# EAGLE design CHIP_dispv3.0 (EAGLE 7.6.0)
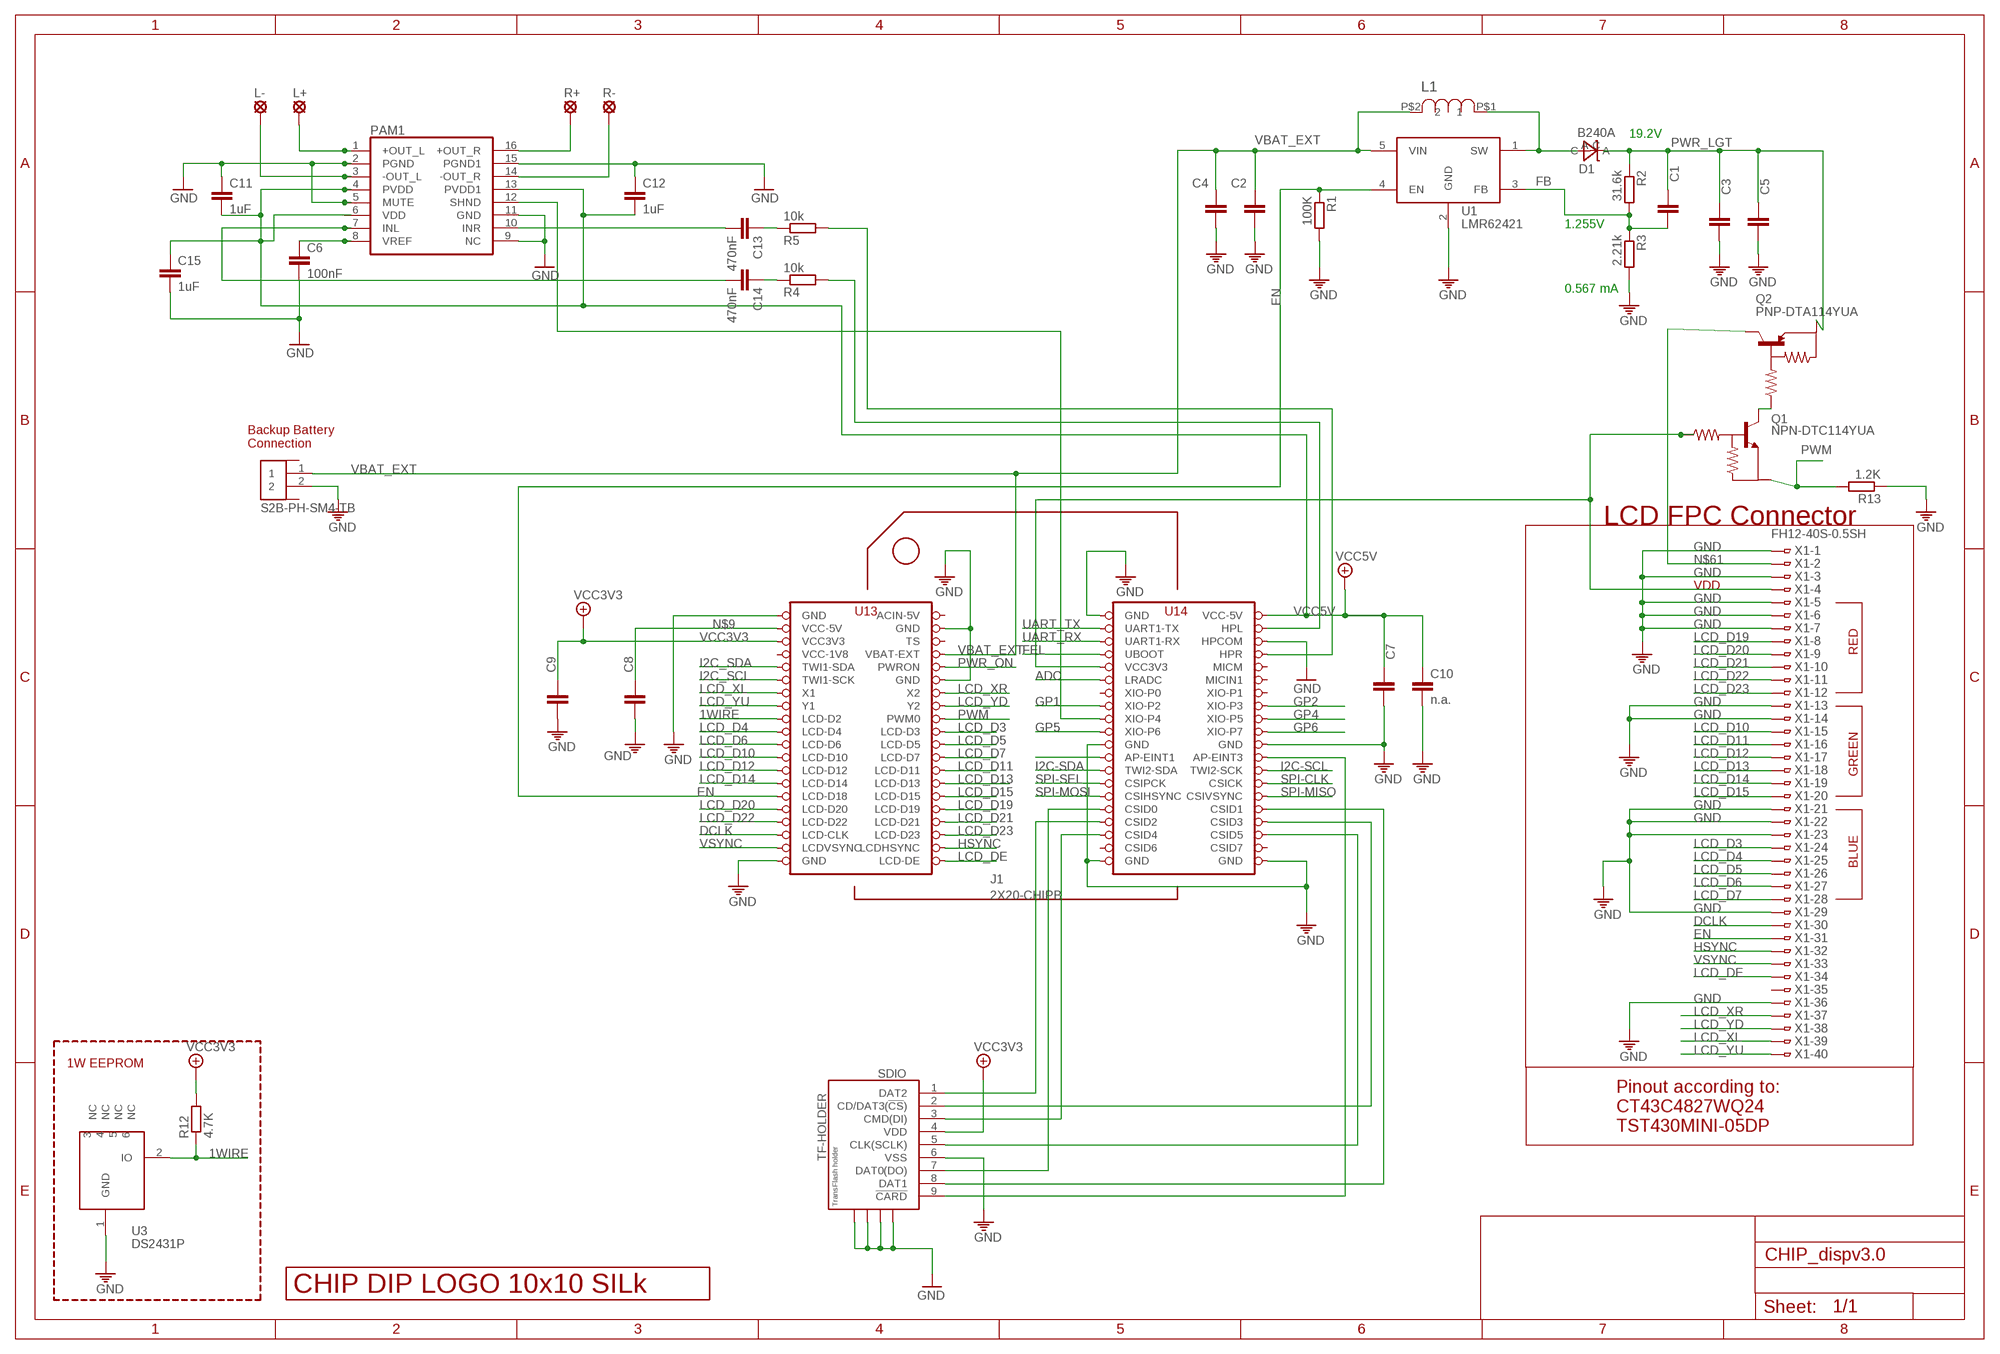
[diagram p0: schematic, sheet 1]

## Parts
C1  220pF  C-EUC0805  [C0805]
C2  100nF  C-EUC0805  [C0805]
C3  100nF  C-EUC0805  [C0805]
C4  22uF  C-EUC0805  [C0805]
C5  22uF  C-EUC0805  [C0805]
C6  100nF  C-EUC0805  [C0805]
C7  n.a.  C-EUC0805  [C0805]
C8  100nF  C-EUC0805  [C0805]
C9  100nF  C-EUC0805  [C0805]
C10  n.a.  C-EUC0805  [C0805]
C11  1uF  C-EUC0805  [C0805]
C12  1uF  C-EUC0805  [C0805]
C13  470nF  C-EUC0805  [C0805]
C14  470nF  C-EUC0805  [C0805]
C15  1uF  C-EUC0805  [C0805]
D1  B240A  DIODE_SCHTKY_B240  [DO-214AC]
J1  2X20-CHIPB  [2X20CHIP_SM]
J3  S2B-PH-SM4-TB  [S2B-PH-SM4-TB]
L1  SRN6045-100M  [SRN6045]
L+  SE11  [SE11]
L-  SE11  [SE11]
PAM1  PAM8403  [SOP-16]
Q1  NPN-DTC114YUA  [SOT323]
Q2  PNP-DTA114YUA  [SOT323]
R1  100K  R-EU_M0805  [M0805]
R2  31.6k  R-EU_M0805  [M0805]
R3  2.21k  R-EU_M0805  [M0805]
R4  10k  R-EU_R0805  [R0805]
R5  10k  R-EU_R0805  [R0805]
R12  4.7K  R-EU_M0805  [M0805]
R13  1.2K  R-EU_M0805  [M0805]
R+  SE11  [SE11]
R-  SE11  [SE11]
SDIO  TF-HOLDER  [TF-PULL]
U1  LMR62421  [SOT23-5]
U3  DS2431P  [TSOC6]
U$2  LOGO_10X10_SILK  [LOGO2_10X10_SILK]
X1  FH12-40S-0.5SH  [FH12-40S-0.5SH]

## Nets
1WIRE: J1.LCD-D2 R12.1 U3.2(IO)
ADC: J1.LRADC
DCLK: J1.LCD-CLK X1.30
EN: J1.LCD-D18 R1.1 U1.4(EN) X1.31
FB: C1.2 R2.2 R3.1 U1.3(FB)
FEL: J1.FEL(UBOOT)
GND: C2.2 C3.2 C4.2 C5.2 C6.2 C7.2 C8.2 C9.2 C10.2 C11.1 C12.1 C15.2 J1.GND@1(GND) J1.GND@2(GND) J1.GND@3(GND) J1.GND@4(GND) J1.GND@5(GND) J1.GND@6(GND) J1.GND@7(GND) J1.GND@8(GND) J1.GND@10(GND) J1.HPCOM J3.2 PAM1.2(PGND) PAM1.5(MUTE) PAM1.9(NC) PAM1.11(GND) PAM1.15(PGND1) R1.2 R3.2 R13.1 SDIO.6(VSS) SDIO.S1 SDIO.S2 SDIO.S3 SDIO.S4 U1.2(GND) U3.1(GND) X1.1 X1.3 X1.5 X1.6 X1.7 X1.13 X1.14 X1.21 X1.22 X1.23 X1.29 X1.36
GP1: J1.XIO-P2
GP2: J1.XIO-P3
GP3: J1.XIO-P4 PAM1.12(SHND)
GP4: J1.XIO-P5
GP5: J1.XIO-P6
GP6: J1.XIO-P7
HSYNC: J1.LCD-HSYNC(LCDHSYNC) X1.32
I2C-SCL: J1.TWI2-SCK
I2C-SDA: J1.TWI2-SDA
I2C_SCL: J1.TWI1-SCK
I2C_SDA: J1.TWI1-SDA
KPD_INT: J1.AP-EINT1
LCD_D3: J1.LCD-D3 X1.24
LCD_D4: J1.LCD-D4 X1.25
LCD_D5: J1.LCD-D5 X1.26
LCD_D6: J1.LCD-D6 X1.27
LCD_D7: J1.LCD-D7 X1.28
LCD_D10: J1.LCD-D10 X1.15
LCD_D11: J1.LCD-D11 X1.16
LCD_D12: J1.LCD-D12 X1.17
LCD_D13: J1.LCD-D13 X1.18
LCD_D14: J1.LCD-D14 X1.19
LCD_D15: J1.LCD-D15 X1.20
LCD_D19: J1.LCD-D19 X1.8
LCD_D20: J1.LCD-D20 X1.9
LCD_D21: J1.LCD-D21 X1.10
LCD_D22: J1.LCD-D22 X1.11
LCD_D23: J1.LCD-D23 X1.12
LCD_DE: J1.LCD-DE X1.34
LCD_XL: J1.X1 X1.39
LCD_XR: J1.X2 X1.37
LCD_YD: J1.Y2 X1.38
LCD_YU: J1.Y1 X1.40
N$1: J1.CSID0 SDIO.7(DAT0(DO))
N$9: C8.1 J1.VCC5V@0(VCC-5V)
N$25: J1.CSID4 SDIO.3(CMD(DI))
N$26: J1.VCC3V3@1(VCC3V3) Q1.1(IN) X1.4
N$27: J1.CSID1 SDIO.8(DAT1)
N$28: J1.CSID3 SDIO.2(CD/DAT3(!CS!))
N$31: J1.CSID2 SDIO.1(DAT2)
N$32: L+.MP PAM1.1(+OUT_L)
N$33: L-.MP PAM1.3(-OUT_L)
N$34: PAM1.16(+OUT_R) R+.MP
N$35: PAM1.14(-OUT_R) R-.MP
N$36: C14.2 PAM1.7(INL)
N$37: J1.HPR R5.2
N$38: C6.1 PAM1.8(VREF)
N$39: C13.2 PAM1.10(INR)
N$40: J1.HPL R4.2
N$41: C13.1 R5.1
N$42: C14.1 R4.1
N$44: J1.CSID5 SDIO.5(CLK(SCLK))
N$45: J1.AP-EINT3 SDIO.9(!CARD)
N$61: Q2.3(OUT) X1.2
N$63: Q1.3(OUT) Q2.1(IN)
PWM: J1.PWM0 Q1.2(GND) R13.2
PWR_LGT: C1.1 C3.1 C5.1 D1.C Q2.2(GND) R2.1
PWR_ON: J1.PWRON
SPI-CLK: J1.CSICK
SPI-MISO: J1.CSIVSYNC
SPI-MOSI: J1.CSIHSYNC
SPI-SEL: J1.CSIPCK
UART_RX: J1.UART1-RX
UART_TX: J1.UART1-TX
VBAT_EXT: C2.1 C4.1 J1.BAT(VBAT-EXT) J3.1 L1.P$2 U1.5(VIN)
VCC3V3: C9.1 J1.VCC3V3 R12.2 SDIO.4(VDD)
VCC5V: C7.1 C10.1 C11.2 C12.2 C15.1 J1.VCC5V@1(VCC-5V) PAM1.4(PVDD) PAM1.6(VDD) PAM1.13(PVDD1)
VREG_OUTPUT: D1.A L1.P$1 U1.1(SW)
VSYNC: J1.LCD-VSYNC(LCDVSYNC) X1.33
Unconnected: J1.CHG-IN(ACIN-5V) J1.CSID6 J1.CSID7 J1.MICIN1 J1.MICM J1.TS J1.XIO-P0 J1.XIO-P1 J3.MNT1 J3.MNT2 U3.3(NC) U3.4(NC) U3.5(NC) U3.6(NC) X1.35

## Notes on the sheet
- 19.2V
- 1.255V
- 0.567 mA
- Backup Battery
  Connection
- LCD FPC Connector
- VDD
- RED
- GREEN
- BLUE
- 1W EEPROM
- Pinout according to:
  CT43C4827WQ24
  TST430MINI-05DP

## Power pins joined to a net without a drawn wire
VCC-1V8: J1.VCC1V8(VCC-1V8)

## Library data of the parts
C1-C15 = rcl:C-EU: CAPACITOR, European symbol
D1 = Keyboard v0_5:DIODE_SCHTKY_B240; DESCRIPTION: DIODE SMD General Purpose 400V 1A 1.4W RoHS DO-214AC; FOOTPRINT: DO-214AC; LINK: http://www.digikey.com/product-detail/en/B240A-13-F/B240A-FDICT-ND/717810; MFG: DIGIKEY; MFG_PN: B240A-FDICT-ND; PART_TYPE: DIODE; PRICE: 0.11; VENDOR: DIODES; VENDOR_PART_NUMBER: B240A-13-F
J1 = JKW_CHIP:2X20-CHIP: Through hole layout with chip reference
J3 = Keyboard v0_5:S2B-PH-SM4-TB; DESCRIPTION: 2 pin con, 2MM RA, SMD; FOOTPRINT: S2B-PH-SM4-TB; LINK: http://www.digikey.com/product-detail/en/S2B-PH-SM4-TB(LF)(SN)/455-1749-1-ND/926846; MFG: DIGIKEY; MFG_PN: 455-1749-1-ND; PART_TYPE: CON; PRICE: 0.26; VENDOR: JST; VENDOR_PART_NUMBER: S2B-PH-SM4-TB(LF)(SN)
L1 = Keyboard v0_5:SRN6045-100M; DESCRIPTION: power inductor 10uH 2.5A 58.6 mohm; FOOTPRINT: SRN6045; LINK: http://www.digikey.com/product-detail/en/SRN6045-100M/SRN6045-100MTR-ND/2756120; MFG: DIGIKEY; MFG_PN: SRN6045-100MTR-ND; PART_TYPE: IND; PRICE: 0.15; TOLLERANCE: ±20%; VENDOR: BOURNS; VENDOR_PART_NUMBER: SRN6045-100M
L+ L- R+ R- = solpad:SE11: SOLDER PAD RTM, drill 1,1mm, distributor Buerklin, 07F810
PAM1 = JKW_CHIP:PAM8403: Dual channel audio amplifier IC - PAM8403
Q1 = PocketCHIP-Components-v0.72:NPN-DTC114YUA
Q2 = PocketCHIP-Components-v0.72:PNP-DTA114YUA
R1-R5 R12 R13 = rcl:R-EU_: RESISTOR, European symbol
SDIO = JKW_CHIP:TF-HOLDER: TF / Micro SD socket is PUSH-PUSH type, the card can be pushed into and auto locked and pushed out by simply press the card. Surface Mounting type.
U1 = PocketCHIP-Components-v0.7:LMR62421; DESCRIPTION: dc/dc step up, 2.1A, 1.6mhz, SOT-23-5; FOOTPRINT: SOT23-5; LINK: http://www.digikey.com/product-detail/en/LMR62421XMFE%2FNOPB/LMR62421XMFE%2FNOPBCT-ND/2777085; MFG: DIGIKEY; MFG_PN: LMR62421XMFE/NOPBCT-ND; PART_TYPE: IC; PRICE: 0.8; VENDOR: TEXAS INSTRUMENTS; VENDOR_PART_NUMBER: LMR62421XMFE/NOPB
U3 = Keyboard v0_5:DS2431: 1024-Bit EEPROM This chip provides a 4x256 Bit EEPROM, which can be programmed@5V. Write protection and OTP emulation are available, too. Author: Jan Kandziora <jjj@gmx.de>; DESCRIPTION: IC, 1024-Bit, 1-Wire EEPROM, TSOC6; FOOTPRINT: TSOC6; LINK: http://www.digikey.com/product-detail/en/DS2431P%2BT%26R/DS2431P%2BT%26RCT-ND/3647900; MFG: DIGIKEY; MFG_PN: DS2431P+T&RCT-ND; PART_TYPE: IC; PRICE: 0.98; VENDOR: MAXIM; VENDOR_PART_NUMBER: DS2431P+T&R
U$2 = JKW_CHIP:LOGO_10X10_SILK
X1 = Keyboard v0_5:FH12-40S-0.5S: 0.5mm Pitch Connectors For FPC/FFC Source: Data sheet <http://www.hirose.co.jp/cataloge_hp/e58605370.pdf>; DESCRIPTION: CON ffc smd, bottom contact 40pos, 0.50mm R/A; FOOTPRINT: FH12-40S-0.5SH; LINK: http://www.digikey.com/product-detail/en/FH12-40S-0.5SH(55)/HFJ140CT-ND/1110388; MFG: DIGIKEY; MFG_PN: HFJ140CT-ND; VENDOR: HIROSE; VENDOR_PART_NUMBER: FH12-40S-0.5SH(55)

## Board
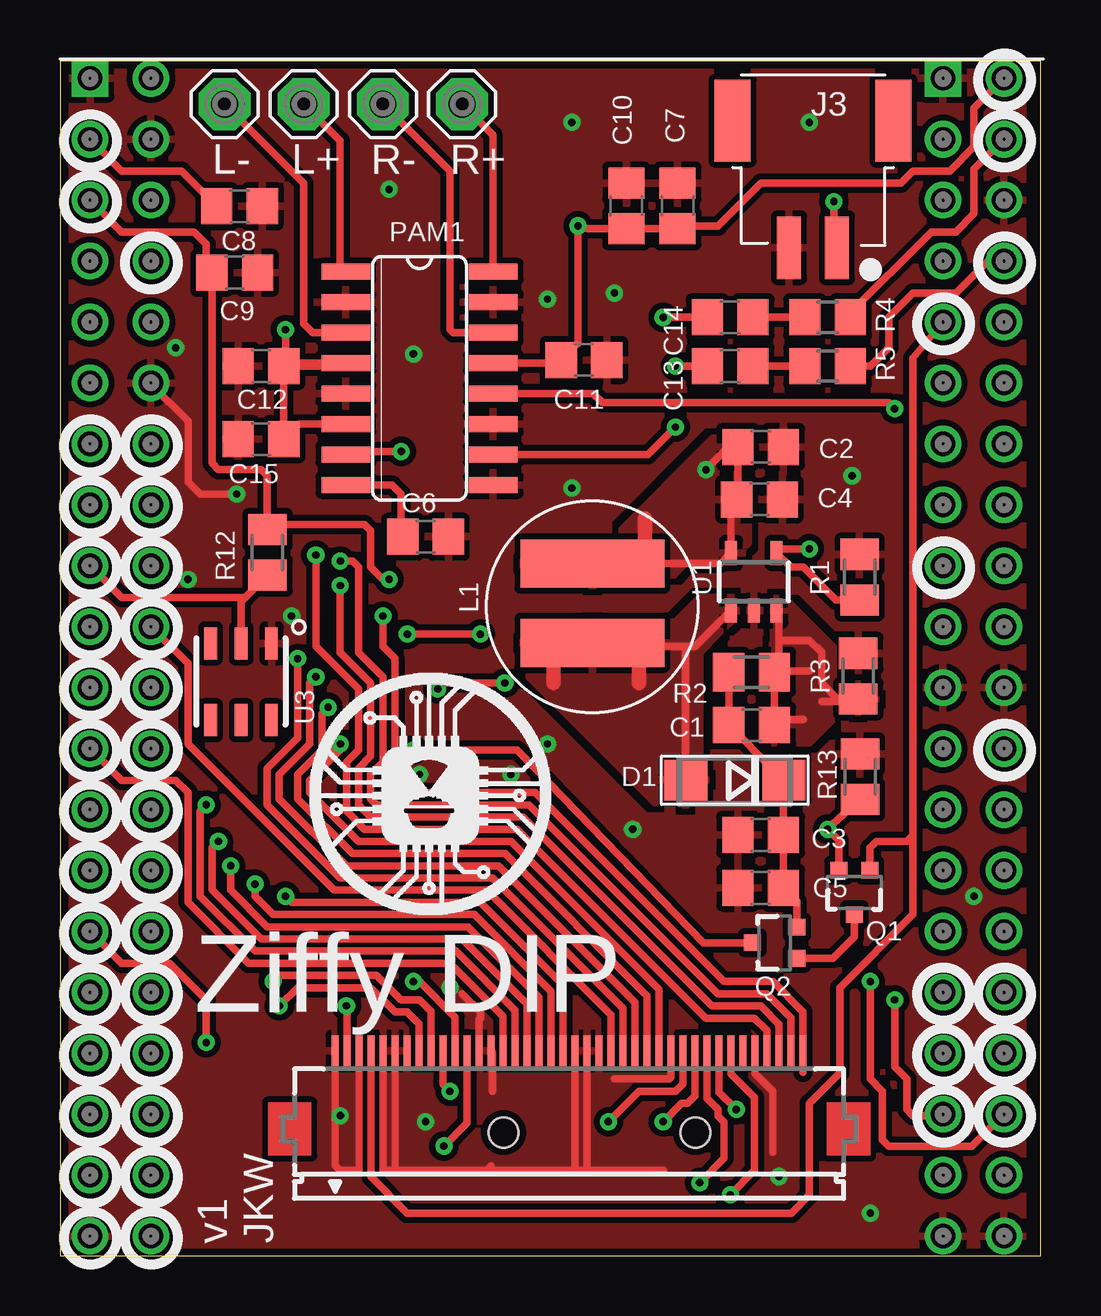
[diagram p1: board, top side]
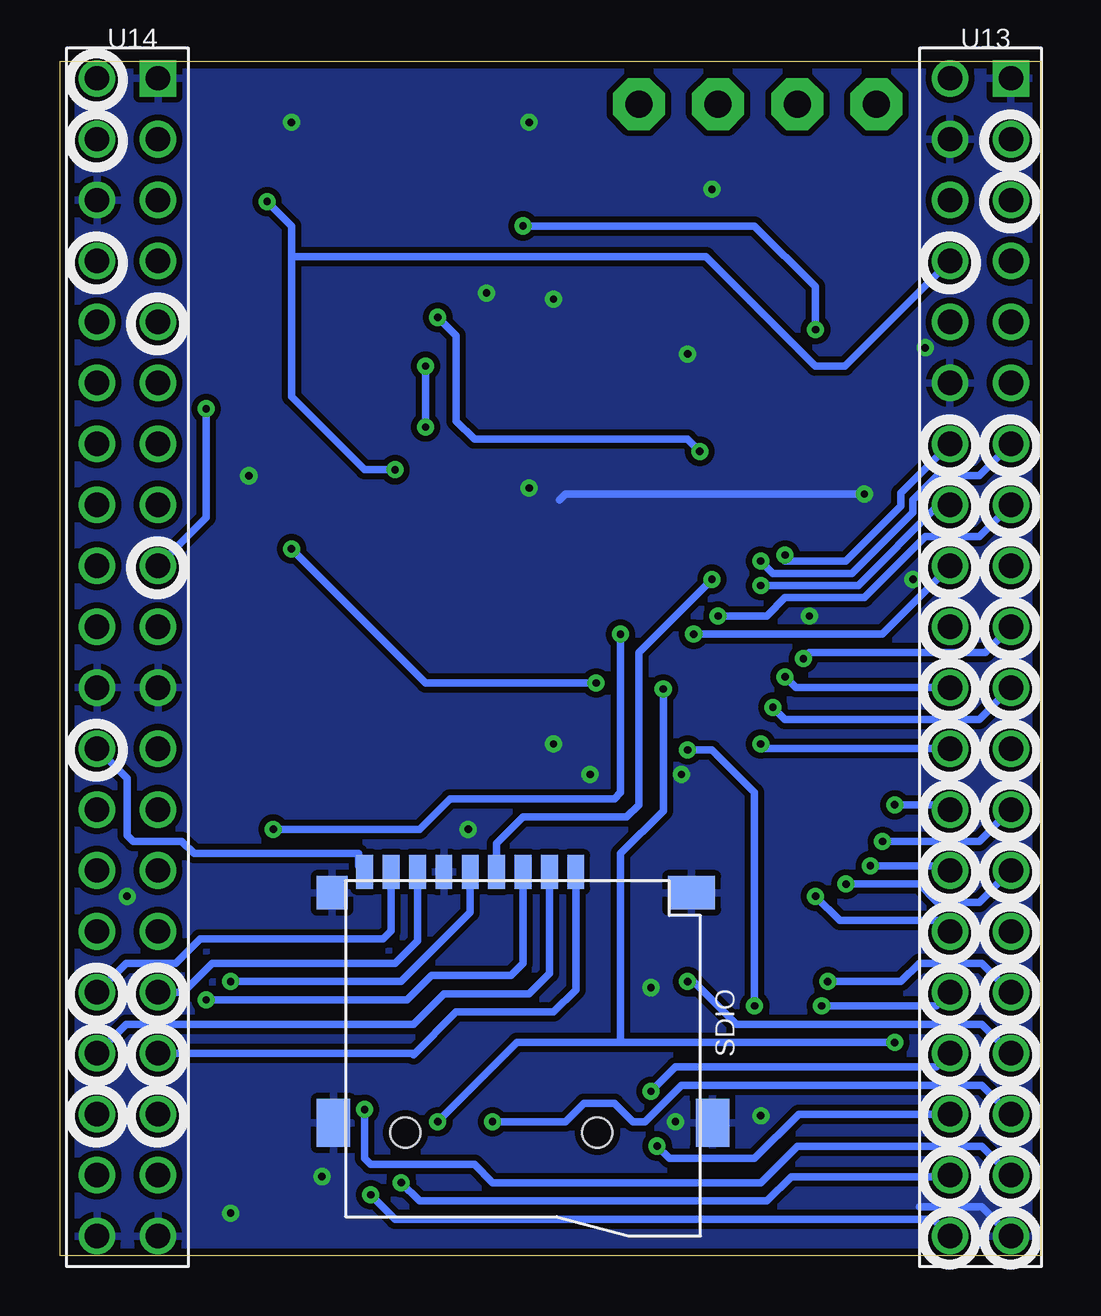
[diagram p2: board, bottom side, seen from below]

Size 40.89 x 49.78 mm. Coordinates in mm from the lower left corner, seen from the top.
Outline: 0,0 40.89,0 40.89,49.78 0,49.78 0,0
Copper layers (1*2*15*16): Top 0.035mm / dielectric 0.2mm / Route2 0.035mm / dielectric 0.2mm / Route15 0.035mm / dielectric 0.2mm / Bottom 0.035mm
Design rules "Hampoo *": minimum track width 3mil, minimum drill 8mil, track to track 3mil, track to pad 3mil, pad to pad 3mil, via to via 3mil, smd to smd 3mil, copper to edge 12mil, drill to drill 8mil, minimum pad ring 10mil, minimum via ring 8mil, stop-mask expansion 4mil, vias tented up to drill 24mil, thermal gap 10mil

### Footprints (pad centres in the part's own frame; a part is rotated, then mirrored left to right if it is on the bottom)
C0805 = smd 1.3 x 1.5: 1 -0.95,0; 2 0.95,0
DO-214AC = smd 1.8 x 1.7: A 2.05,0; C -2.05,0
2X20CHIP_SM = drill 1.016: AP-EINT1 36.81,21.65; AP-EINT3 39.35,21.65; BAT 3.79,41.97; CHG-IN 3.79,49.59; CSICK 39.35,16.57; CSID0 36.81,11.49; CSID1 39.35,11.49; CSID2 36.81,8.95; CSID3 39.35,8.95; CSID4 36.81,6.41; CSID5 39.35,6.41; CSID6 36.81,3.87; CSID7 39.35,3.87; CSIHSYNC 36.81,14.03; CSIPCK 36.81,16.57; CSIVSYNC 39.35,14.03; FEL 36.81,41.97; GND@1 3.79,36.89; GND@2 1.25,1.33; GND@4 39.35,24.19; GND@5 39.35,1.33; GND@6 36.81,1.33; GND@7 36.81,24.19; GND@10 3.79,47.05; HPCOM 39.35,44.51; HPL 39.35,47.05; HPR 39.35,41.97; LCD-CLK 1.25,6.41; LCD-D2 1.25,29.27; LCD-D3 3.79,26.73; LCD-D4 1.25,26.73; LCD-D5 3.79,24.19; LCD-D6 1.25,24.19; LCD-D7 3.79,21.65; LCD-D10 1.25,21.65; LCD-D11 3.79,19.11; LCD-D12 1.25,19.11; LCD-D13 3.79,16.57; LCD-D14 1.25,16.57; LCD-D15 3.79,14.03; LCD-D18 1.25,14.03; LCD-D19 3.79,11.49; LCD-D20 1.25,11.49; LCD-D21 3.79,8.95; LCD-D22 1.25,8.95; LCD-D23 3.79,6.41; LCD-DE 3.79,1.33; LCD-HSYNC 3.79,3.87; LCD-VSYNC 1.25,3.87; LRADC 36.81,36.89; MICIN1 39.35,36.89; MICM 39.35,39.43; PWM0 3.79,29.27; PWRON 3.79,39.43; TS 3.79,44.51; TWI1-SCK 1.25,36.89; TWI1-SDA 1.25,39.43; TWI2-SCK 39.35,19.11; TWI2-SDA 36.81,19.11; UART1-RX 36.81,44.51; UART1-TX 36.81,47.05; VCC1V8 1.25,41.97; VCC3V3 1.25,44.51; VCC3V3@1 36.81,39.43; VCC5V@0 1.25,47.05; VCC5V@1 39.35,49.59; X1 1.25,34.35; X2 3.79,34.35; XIO-P0 36.81,34.35; XIO-P1 39.35,34.35; XIO-P2 36.81,31.81; XIO-P3 39.35,31.81; XIO-P4 36.81,29.27; XIO-P5 39.35,29.27; XIO-P6 36.81,26.73; XIO-P7 39.35,26.73; Y1 1.25,31.81; Y2 3.79,31.81 | drill 1.016 square: GND@3 1.25,49.59; GND@8 36.81,49.59
S2B-PH-SM4-TB = smd 2.6 x 1: 1 0,-1; 2 0,1 | smd 3.4 x 1.5: MNT1 5.3,3.35; MNT2 5.3,-3.35
SRN6045 = smd 2 x 6: P$1 1.5,0; P$2 -1.8,0
SE11 = drill 1.118 pad 2.159 octagon: MP 0,0
SOP-16 = smd 0.66 x 2.032: 1 -4.445,-3.073; 2 -3.175,-3.073; 3 -1.905,-3.073; 4 -0.635,-3.073; 5 0.635,-3.073; 6 1.905,-3.073; 7 3.175,-3.073; 8 4.445,-3.073; 9 4.445,3.073; 10 3.175,3.073; 11 1.905,3.073; 12 0.635,3.073; 13 -0.635,3.073; 14 -1.905,3.073; 15 -3.175,3.073; 16 -4.445,3.073
SOT323 = smd 0.7 x 0.7: 1 -0.65,-0.925; 2 0.65,-0.925; 3 0,0.925
M0805 = smd 1.3 x 1.6: 1 -0.95,0; 2 0.95,0
R0805 = smd 1.3 x 1.5: 1 -0.95,0; 2 0.95,0
TF-PULL = smd 0.7 x 1.4: 1 -2.2,-7.62; 2 -1.1,-7.62; 3 0,-7.62; 4 1.1,-7.62; 5 2.2,-7.62; 6 3.3,-7.62; 7 4.4,-7.62; 8 5.5,-7.62; 9 6.6,-7.62 | smd 1.4 x 2: S1 -7.9,2.85; S2 7.9,2.85 | smd 1.28 x 1.4: S3 7.96,-6.75 | smd 1.95 x 1.4: S4 -7.025,-6.75 | hole 1.25: -3.1,3.25; 4.9,3.25
SOT23-5 = smd 0.5 x 1: 1 -0.95,-1.2; 2 0,-1.2; 3 0.95,-1.2; 4 0.95,1.2; 5 -0.95,1.2
TSOC6 = smd 0.53 x 1.33: 1 -1.27,-1.6; 2 0,-1.6; 3 1.27,-1.6; 4 1.27,1.6; 5 0,1.6; 6 -1.27,1.6
FH12-40S-0.5SH = smd 0.3 x 1.3: 1 -9.75,3.25; 2 -9.25,3.25; 3 -8.75,3.25; 4 -8.25,3.25; 5 -7.75,3.25; 6 -7.25,3.25; 7 -6.75,3.25; 8 -6.25,3.25; 9 -5.75,3.25; 10 -5.25,3.25; 11 -4.75,3.25; 12 -4.25,3.25; 13 -3.75,3.25; 14 -3.25,3.25; 15 -2.75,3.25; 16 -2.25,3.25; 17 -1.75,3.25; 18 -1.25,3.25; 19 -0.75,3.25; 20 -0.25,3.25; 21 0.25,3.25; 22 0.75,3.25; 23 1.25,3.25; 24 1.75,3.25; 25 2.25,3.25; 26 2.75,3.25; 27 3.25,3.25; 28 3.75,3.25; 29 4.25,3.25; 30 4.75,3.25; 31 5.25,3.25; 32 5.75,3.25; 33 6.25,3.25; 34 6.75,3.25; 35 7.25,3.25; 36 7.75,3.25; 37 8.25,3.25; 38 8.75,3.25; 39 9.25,3.25; 40 9.75,3.25

### Placement (x,y rotation side)
C1  28.83,22.12 0 top
C2  29.21,33.71 0 top
C3  29.21,17.54 180 top
C4  29.16,31.53 0 top
C5  29.21,15.33 180 top
C6  15.24,29.97 0 top
C7  25.75,43.76 90 top
C8  7.48,43.75 0 top
C9  7.29,40.98 0 top
C10  23.61,43.76 90 top
C11  21.84,37.34 180 top
C12  8.38,37.08 0 top
C13  27.94,37.08 180 top
C14  27.94,39.12 180 top
C15  8.38,34.04 180 top
D1  28.13,19.83 180 top
J1  0,-0.51 0 top
J3  31.39,42.01 90 top
L1  22.19,27.05 270 top
L+  10.16,48.01 180 top
L-  6.86,48.01 180 top
PAM1  14.99,36.58 270 top
Q1  33.11,15.15 180 top
Q2  29.79,13.05 90 top
R1  33.33,28.29 90 top
R2  28.83,24.33 0 top
R3  33.27,24.16 90 top
R4  32,39.12 0 top
R5  32,37.08 0 top
R12  8.65,29.32 90 top
R13  33.35,19.97 270 top
R+  16.76,48.01 180 top
R-  13.46,48.01 0 top
SDIO  21.59,8.38 180 bottom
U1  28.92,28.09 0 top
U3  7.55,23.93 180 top
U$2  10.41,14.22 0 top
X1  21.22,5.29 0 top

### Tracks (layer width: path | path; a pad name or v marks a point on that pad's centre or on a via)
1WIRE
  Top 0.305: J1.LCD-D2 2.58,27.43 7.71,27.43 | 7.71,27.43 R12.1 | U3.2 7.55,27.27 7.71,27.43
DCLK  (via drill 0.3)
  Top 0.305: X1.30 25.97,7.18 25.65,6.86 24.13,6.86 v22.86,5.59
  Bottom 0.305: J1.LCD-CLK 2.46,7.11 14.99,7.11 16.51,5.59 17.02,5.59 17.78,6.35 19.05,6.35 19.81,5.59 v22.86,5.59
EN  (via drill 0.3)
  Top 0.305: J1.LCD-D18 2.58,12.19 4.57,12.19 6.1,10.67 v6.1,8.89 | X1.31 26.47,6.66 26.16,6.35 25.91,6.35 v25.15,5.59 | R1.1 32.35,27.34 30.99,28.7 30.46,28.7 U1.4 30.04,29.46 v31.24,29.46 | v18.54,23.88 16,23.88 v15.75,23.62
  Bottom 0.305: v6.1,8.89 17.53,8.89 | 17.53,8.89 21.84,8.89 v25.15,5.59 | v15.75,23.62 15.75,18.54 17.53,16.76 17.53,8.89 | v18.54,23.88 25.65,23.88 v31.24,29.46
FB
  Top 0.305: 29.97,25.65 31.24,25.65 31.75,25.15 31.75,23.88 32.41,23.21 R3.1 33.17,23.11 33.02,23.11 32.77,23.11 31.75,23.11 | U1.3 29.97,26.8 29.97,25.65 | C1.2 R2.2 29.97,24.52 29.97,25.65 | 29.97,22.35 30.99,22.35 | 29.97,24.38 31.24,24.38
  pour Top: 29.46,21.34 29.46,25.15 29.72,25.65 29.72,27.43 30.23,27.43 32.26,25.4 32.26,23.88 34.04,23.88 34.04,22.61 32.51,22.61 31.24,21.34
GND  (via drill 0.3)
  Top 0.305: 13.97,3.56 17.78,3.56 | 17.78,3.56 21.34,3.56 | 21.34,3.56 21.84,3.56 | 21.84,3.56 25.15,3.56 | X1.22 21.97,3.68 21.84,3.56 | X1.21 21.47,3.69 21.34,3.56 | 17.97,3.75 17.78,3.56 | PAM1.2 12.04,39.88 | v7.37,31.75 5.84,31.75 5.33,32.26 5.33,34.8 3.81,36.32 | X1.1 11.47,3.77 11.68,3.56 12.45,3.56 12.47,3.58 X1.3 | 13.97,3.56 13.46,3.56 13.47,3.57 X1.5 | X1.6 13.97,3.56 | X1.36 28.97,7.6 29.72,6.86 29.72,4.32 | U1.2 28.96,26.93 | 16.76,10.92 17.53,10.16 17.53,9.91 17.47,9.85 X1.13 | X1.14 18.03,8.47 18.03,6.86 | X1.29 25.47,7.44 25.4,7.37 23.11,7.37
  Bottom 0.305: J1.GND@2 2.46,2.03 5.08,2.03 | 20.07,31.5 19.81,31.75 v7.37,31.75
  other vias: 4.83,37.85 23.11,40.13 21.34,47.24 21.34,32 9.65,26.67 5.33,28.19 31.24,47.24 20.32,39.88 14.73,37.59 20.32,21.34 33.02,32.51 13.72,44.45 33.78,1.78 29.97,3.3 23.88,17.78 38.1,14.99 18.8,20.07 14.99,20.07 15.24,5.59 16.26,11.18 11.68,5.84
  pour Bottom (isolate 0.254, rank 3): 0.51,49.78 40.13,49.78 40.13,0.25 0.51,0.25
  pour Top (isolate 0.254, rank 3): 0.51,49.78 40.13,49.78 40.13,0.25 0.51,0.25
GP3  (via drill 0.3)
  Top 0.305: PAM1.12 22.23,35.94 22.61,35.56 34.54,35.56 v34.8,35.31
  Bottom 0.305: v34.8,35.31 34.8,30.77 J1.XIO-P4
HSYNC  (via drill 0.3)
  Top 0.305: 26.97,3.35 v26.67,3.05 27.69,4.06 27.69,5.59 27.43,5.84 27.43,6.1 26.97,6.56 X1.32
  Bottom 0.305: J1.LCD-HSYNC 3.85,3.3 10.41,3.3 11.43,2.29 25.91,2.29 v26.67,3.05
LCD_D3
  Top 0.305: J1.LCD-D3 5.33,24.68 5.33,21.34 11.43,15.24 17.78,15.24 22.97,10.05 X1.24
  Bottom 0.305: 3.85,26.16 J1.LCD-D3
LCD_D4  (via drill 0.3)
  Top 0.305: X1.25 23.47,10.31 18.03,15.75 11.68,15.75 8.64,18.8 8.64,20.32 9.91,21.59 v9.91,24.89
  Bottom 0.305: J1.LCD-D4 2.33,25.15 9.65,25.15 v9.91,24.89
LCD_D5  (via drill 0.3)
  Top 0.305: v10.67,24.13 10.41,23.88 10.41,21.34 9.14,20.07 9.14,19.05 11.94,16.26 18.29,16.26 23.97,10.57 X1.26
  Bottom 0.305: v10.67,24.13 10.22,23.68 J1.LCD-D5
LCD_D6  (via drill 0.3)
  Top 0.305: X1.27 24.47,10.83 18.54,16.76 12.19,16.76 9.91,19.05 9.91,20.07 10.92,21.08 10.92,22.61 v11.18,22.86
  Bottom 0.305: J1.LCD-D6 2.58,22.35 10.67,22.35 v11.18,22.86
LCD_D7  (via drill 0.3)
  Top 0.305: X1.28 24.97,11.1 18.8,17.27 12.45,17.27 10.41,19.3 10.41,19.81 11.68,21.08 v11.68,21.34 11.43,21.08
  Bottom 0.305: v11.68,21.34 11.49,21.14 J1.LCD-D7
LCD_D10
  Top 0.305: J1.LCD-D10 2.58,19.81 4.83,19.81 5.33,19.3 5.33,14.73 7.87,12.19 16.26,12.19 18.47,9.98 X1.15
LCD_D11  (via drill 0.3)
  Top 0.305: v6.1,18.8 5.84,18.54 5.84,14.99 8.13,12.7 16.51,12.7 18.97,10.24 X1.16
  Bottom 0.305: v6.1,18.8 3.98,18.8 J1.LCD-D11
LCD_D12  (via drill 0.3)
  Top 0.305: v6.6,17.27 6.35,17.02 6.35,15.24 8.38,13.21 16.76,13.21 19.47,10.5 X1.17
  Bottom 0.305: J1.LCD-D12 2.58,17.27 v6.6,17.27
LCD_D13  (via drill 0.3)
  Top 0.305: v7.11,16.26 7.11,15.24 8.64,13.72 17.02,13.72 19.97,10.76 X1.18
  Bottom 0.305: v7.11,16.26 3.98,16.26 J1.LCD-D13
LCD_D14  (via drill 0.3)
  Top 0.305: X1.19 20.47,11.02 17.27,14.22 8.89,14.22 8.13,14.99 v8.13,15.49
  Bottom 0.305: J1.LCD-D14 2.58,14.73 4.32,14.73 5.08,15.49 v8.13,15.49
LCD_D15  (via drill 0.3)
  Top 0.305: X1.20 20.97,11.29 17.53,14.73 9.65,14.73 v9.4,14.99
  Bottom 0.305: v9.4,14.99 8.38,13.97 4.24,13.97 J1.LCD-D15
LCD_D19  (via drill 0.3)
  Top 0.305: X1.8 14.97,9.67 14.48,10.16 13.97,10.16 12.95,11.18 9.91,11.18 v9.14,10.41
  Bottom 0.305: v9.14,10.41 4.36,10.41 J1.LCD-D19
LCD_D20  (via drill 0.3)
  Top 0.305: X1.9 15.47,10.18 14.99,10.67 14.22,10.67 13.21,11.68 9.14,11.68 v8.89,11.43
  Bottom 0.305: J1.LCD-D20 2.46,12.19 5.08,12.19 5.84,11.43 v8.89,11.43
LCD_D21  (via drill 0.3)
  Top 0.305: v16.26,6.86 15.97,7.14 X1.10
  Bottom 0.305: J1.LCD-D21 4.36,7.87 15.24,7.87 v16.26,6.86
LCD_D22  (via drill 0.3)
  Top 0.305: X1.11 16.47,9.94 14.99,11.43 v14.73,11.43
  Bottom 0.305: J1.LCD-D22 2.46,9.65 12.7,9.65 14.48,11.43 v14.73,11.43
LCD_D23  (via drill 0.3)
  Top 0.305: 16.97,8.17 X1.12 16.97,5.54 v16,4.57
  Bottom 0.305: J1.LCD-D23 10.1,5.9 11.94,4.06 15.49,4.06 v16,4.57
LCD_DE  (via drill 0.3)
  Top 0.305: X1.34 27.97,7.59 28.96,6.6 28.96,3.56 v27.94,2.54
  Bottom 0.305: J1.LCD-DE 4.49,1.52 26.92,1.52 v27.94,2.54
LCD_XL  (via drill 0.3)
  Top 0.305: v11.68,28.96 12.19,28.96 12.45,28.7 12.45,25.15 13.46,24.13 13.46,20.57 12.95,20.07 12.95,19.05 13.21,18.8 19.56,18.8 27.43,10.92 29.46,10.92 30.47,9.91 X1.39
  Bottom 0.305: J1.X1 2.58,32.51 4.32,32.51 5.33,31.5 5.33,30.99 7.87,28.45 11.18,28.45 v11.68,28.96
LCD_XR  (via drill 0.3)
  Top 0.305: v10.67,29.21 10.67,25.4 12.45,23.62 12.45,21.08 11.94,20.57 11.94,18.54 12.7,17.78 19.05,17.78 26.92,9.91 28.96,9.91 29.47,9.39 X1.37
  Bottom 0.305: J1.X2 5.84,31.79 5.84,31.24 8.13,28.96 10.67,28.96 v10.67,29.21
LCD_YD  (via drill 0.3)
  Top 0.305: v11.68,27.94 11.68,25.15 12.95,23.88 12.95,20.83 12.45,20.32 12.45,18.8 12.95,18.29 19.3,18.29 27.18,10.41 29.21,10.41 29.97,9.65 X1.38
  Bottom 0.305: J1.Y2 3.85,31.24 4.32,31.24 7.62,27.94 v11.68,27.94
LCD_YU  (via drill 0.3)
  Top 0.305: 30.97,7.64 X1.40 30.97,10.18 29.72,11.43 27.69,11.43 19.81,19.3 14.22,19.3 13.97,19.56 13.97,24.89 13.46,25.4 v13.46,26.67
  Bottom 0.305: J1.Y1 2.58,29.97 4.83,29.97 7.37,27.43 10.67,27.43 11.43,26.67 v13.46,26.67
N$1
  Bottom 0.305: SDIO.7 25.99,13.13 26.92,12.19 34.54,12.19 35.75,10.98 J1.CSID0
N$9
  Top 0.305: J1.VCC5V@0 2.58,45.21 5.07,45.21 C8.1
N$25  (via drill 0.3)
  Top 0.305: J1.CSID4 36.75,5.84 35.56,5.84 35.31,6.1 35.31,7.37 34.8,7.87 v34.8,10.67
  Bottom 0.305: SDIO.3 21.59,12.19 22.1,11.68 25.4,11.68 26.42,10.67 v34.8,10.67
N$26
  Top 0.305: J1.VCC3V3@1 35.56,37.42 35.56,17.53 | 35.56,17.53 35.56,14.22 32.51,11.18 32.51,7.62 31.24,6.35 31.24,2.54 30.48,1.78 14.48,1.78 12.97,3.28 X1.4 | Q1.1 33.76,17 34.04,17.27 35.31,17.27 35.56,17.53
N$27
  Bottom 0.305: SDIO.8 27.09,13.55 27.43,13.21 35.05,13.21 36.07,12.19 38.14,12.19 J1.CSID1
N$28
  Bottom 0.305: SDIO.2 20.49,11.77 21.34,10.92 24.89,10.92 26.16,9.65 38.14,9.65 J1.CSID3
N$31
  Bottom 0.305: SDIO.1 19.39,11.09 20.32,10.16 24.38,10.16 26.16,8.38 26.22,8.44 J1.CSID2
N$32
  Top 0.305: PAM1.1 11.68,41.25 11.68,46.48 L+.MP
N$33
  Top 0.305: PAM1.3 10.54,38.48 10.16,38.86 10.16,44.7 L-.MP
N$34
  Top 0.305: PAM1.16 18.06,46.71 R+.MP
N$35
  Top 0.305: PAM1.14 16.38,38.48 16.26,38.61 16.26,45.21 R-.MP
N$36  (via drill 0.3)
  Top 0.305: PAM1.7 12.04,33.53 v14.22,33.53 | v25.15,39.12 C14.2
  Bottom 0.305: v14.22,33.53 14.73,34.04 23.62,34.04 24.38,34.8 24.38,38.35 v25.15,39.12
N$37
  Top 0.305: J1.HPR 38.67,41.46 37.34,40.13 35.56,40.13 34.54,39.12 34.54,37.85 33.78,37.08 R5.2
N$38
  Top 0.305: PAM1.8 13.84,32.13 14.22,31.75 14.22,30.04 C6.1
N$39  (via drill 0.3)
  Top 0.305: PAM1.10 24.51,33.4 v25.65,34.54 | v25.65,37.08 C13.2
  Bottom 0.305: v25.65,34.54 v25.65,37.08
N$40
  Top 0.305: J1.HPL 38.1,45.29 38.1,43.43 37.34,42.67 36.32,42.67 32.77,39.12 | 32.77,39.12 32.51,39.12 | 32.77,39.12 R4.2
N$41
  Top 0.305: R5.1 C13.1
N$42
  Top 0.305: R4.1 C14.1
N$44  (via drill 0.3)
  Top 0.305: v33.78,11.43 33.78,7.37 34.29,6.86 34.29,4.83 34.54,4.57 38.02,4.57 J1.CSID5
  Bottom 0.305: SDIO.5 23.79,14.31 26.67,11.43 v33.78,11.43
N$45
  Bottom 0.305: SDIO.9 28.45,16.26 28.45,16.76 35.31,16.76 35.81,17.27 37.85,17.27 38.1,17.53 38.1,19.89 J1.AP-EINT3
N$61  (via drill 0.3)
  Top 0.305: X1.2 11.97,10.38 v11.94,10.41 | 28.54,13.05 Q2.3 26.83,13.05 19.81,20.32 19.05,21.08 v14.73,21.08
  Bottom 0.305: v11.94,10.41 11.94,19.3 13.72,21.08 v14.73,21.08
N$63
  Top 0.305: Q2.1 32.21,12.4 33.11,13.3 Q1.3
PWM  (via drill 0.3)
  Top 0.305: R13.2 32.23,18 v32,17.78 32.46,17.32 Q1.2 | v17.53,25.91 v14.48,25.91
  Bottom 0.305: J1.PWM0 3.79,28.72 6.6,25.91 v14.48,25.91 | v32,17.78 25.91,17.78 24.64,19.05 17.78,19.05 17.53,19.3 v17.53,25.91
PWR_LGT
  Top 0.305: Q2.2 30.72,14.78 C5.1 C3.1 30.16,18.54 D1.C 29.99,19.83 29.72,19.56 29.72,20.28 C1.1 R2.1
VBAT_EXT  (via drill 0.3)
  Top 0.305: v32.26,43.94 32.26,42.15 J3.1 | L1.P$2 27.53,28.85 U1.5 27.97,31.29 C4.1 28.26,31.58 C2.1 27.87,33.71 v26.92,32.77
  Top 0.61: 24.38,28.96 24.38,30.73
  Bottom 0.305: 31.24,41.66 31.24,42.93 v32.26,43.94 | J1.BAT 8.17,37.08 9.4,37.08 13.97,41.66 31.24,41.66 | 31.24,41.66 31.24,35.81 28.19,32.77 v26.92,32.77
  pour Top (isolate 0.254): 19.3,27.94 25.15,27.94 26.16,28.96 27.69,28.96 28.19,28.96 28.45,29.21 28.45,29.46 28.7,29.72 28.7,32.26 28.7,34.29 27.43,34.29 22.86,29.72 21.08,29.72 19.3,29.72
VCC3V3  (via drill 0.3)
  Top 0.305: J1.VCC3V3 2.58,42.67 5.59,42.67 6.1,42.16 6.1,41.22 C9.1 6.33,33.03 6.6,32.77 8.38,32.77 8.64,32.51 8.64,30.29 R12.2 | 8.38,30.54 R12.2 | v13.72,28.19 13.46,28.19 12.95,28.7 12.95,30.23 12.7,30.48 8.86,30.48 R12.2
  Bottom 0.305: SDIO.4 22.69,17.19 21.59,18.29 17.27,18.29 16.76,18.8 16.76,25.15 v13.72,28.19
VCC5V  (via drill 0.3)
  Top 0.305: J1.VCC5V@1 38.1,47.83 38.1,46.23 37.08,45.21 35.56,45.21 35.05,44.7 29.21,44.7 27.43,42.93 25.86,42.93 C7.1 C10.1 21.98,42.81 v21.59,42.93 21.59,38.03 C11.2 20.77,37.21 PAM1.13 | PAM1.6 9.97,34.67 C15.1 C12.2 9.46,37.21 PAM1.4 11.79,37.08 9.4,37.08 v9.4,38.61
  Bottom 0.305: v9.4,38.61 9.4,40.39 11.94,42.93 v21.59,42.93
VREG_OUTPUT
  Top 0.305: U1.1 26.48,25.4 26.16,25.4 | 26.16,25.4 24.13,25.4 22.86,25.4 22.71,25.55 L1.P$1 | D1.A 26.08,25.32 26.16,25.4
  Top 0.61: 24.13,25.4 24.13,23.88 | 20.57,23.88 20.57,25.4 22.04,25.4 L1.P$1
  pour Top (isolate 0.254): 19.3,26.42 19.3,24.38 24.89,18.8 26.67,18.8 26.92,19.05 26.92,20.83 26.67,21.08 26.67,25.15 27.43,25.91 28.19,26.67 28.19,27.43 26.67,27.43 25.65,26.42
VSYNC  (via drill 0.3)
  Top 0.305: X1.33 27.47,6.82 v28.19,6.1
  Bottom 0.305: J1.LCD-VSYNC 2.46,4.57 10.16,4.57 11.68,3.05 22.86,3.05 23.62,3.81 27.94,3.81 28.19,4.06 v28.19,6.1

### Text on the board
tNames: Ziffy DIP | v1 / JKW